# EAGLE design hausbus644 (EAGLE 5.10)
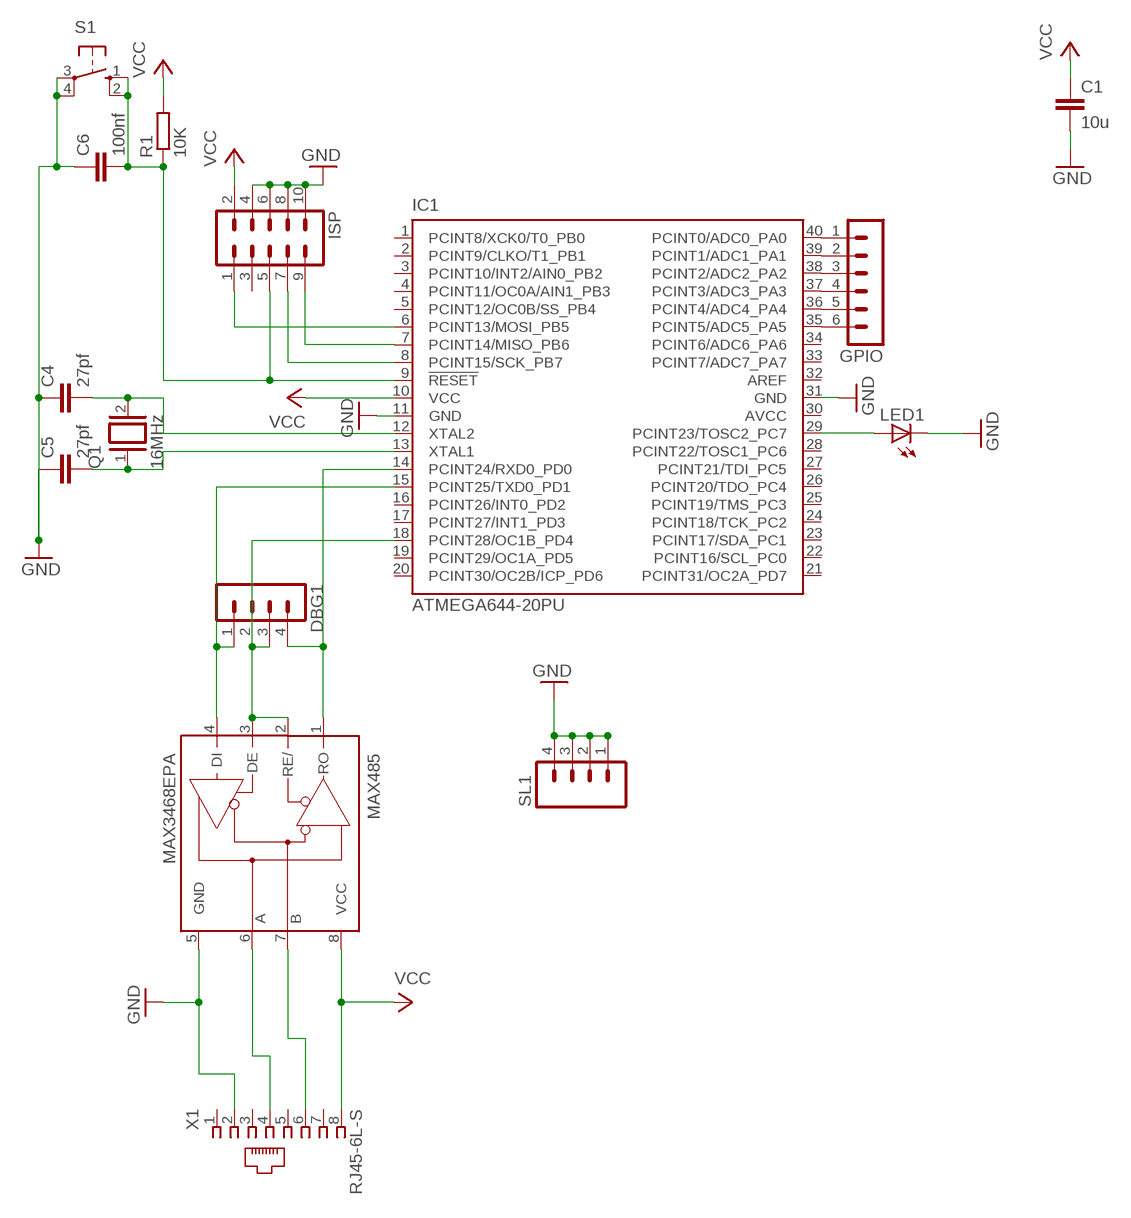
[diagram p0: schematic, sheet 1]

## Parts
C1  10u  C7.5/3  [C7.5B3]
C4  27pf  C2,5-3  [C2.5-3]
C5  27pf  C2,5-3  [C2.5-3]
C6  100nf  C2,5-3  [C2.5-3]
DBG1  MA04-1  [MA04-1]
GPIO  MA06-1  [MA06-1]
IC1  ATMEGA644-20PU  [DIL40]
ISP  ML10  [ML10]
LED1  LED5MM  [LED5MM]
MAX485  MAX3468EPA  [DIL08]
Q1  16MHz  XTAL/S  [QS]
R1  10K  R-EU_0204/7  [0204/7]
S1  10-XX  [B3F-10XX]
SL1  MA04  [04PA]
X1  RJ45-6L-S  [RJ45-NO-SHIELD]

## Nets
GND: C1.2 C4.1 C5.1 C6.1 IC1.11(GND) IC1.31(GND) ISP.4 ISP.6 ISP.8 ISP.10 LED1.K(C) MAX485.5(GND) S1.3(P) S1.4(P1) SL1.1 SL1.2 SL1.3 SL1.4 X1.2
N$1: MAX485.7(B) X1.6
N$2: DBG1.4 IC1.14(PCINT24/RXD0_PD0) MAX485.1(RO)
N$3: DBG1.1 IC1.15(PCINT25/TXD0_PD1) MAX485.4(DI)
N$4: DBG1.2 DBG1.3 IC1.18(PCINT28/OC1B_PD4) MAX485.2(RE/) MAX485.3(DE)
N$5: IC1.6(PCINT13/MOSI_PB5) ISP.1
N$6: C6.2 IC1.9(!RESET) ISP.5 R1.1 S1.1(S) S1.2(S1)
N$7: IC1.7(PCINT14/MISO_PB6) ISP.9
N$8: GPIO.1 IC1.40(PCINT0/ADC0_PA0)
N$9: C4.2 IC1.12(XTAL2) Q1.2
N$10: C5.2 IC1.13(XTAL1) Q1.1
N$11: GPIO.2 IC1.39(PCINT1/ADC1_PA1)
N$12: MAX485.6(A) X1.4
N$13: GPIO.3 IC1.38(PCINT2/ADC2_PA2)
N$14: GPIO.4 IC1.37(PCINT3/ADC3_PA3)
N$15: GPIO.5 IC1.36(PCINT4/ADC4_PA4)
N$16: GPIO.6 IC1.35(PCINT5/ADC5_PA5)
N$17: IC1.29(PCINT23/TOSC2_PC7) LED1.A
N$18: IC1.8(PCINT15/SCK_PB7) ISP.7
VCC: C1.1 IC1.10(VCC) ISP.2 MAX485.8(VCC) R1.2 X1.8
Unconnected: IC1.1(PCINT8/XCK0/T0_PB0) IC1.2(PCINT9/CLKO/T1_PB1) IC1.3(PCINT10/INT2/AIN0_PB2) IC1.4(PCINT11/OC0A/AIN1_PB3) IC1.5(PCINT12/OC0B/SS_PB4) IC1.16(PCINT26/INT0_PD2) IC1.17(PCINT27/INT1_PD3) IC1.19(PCINT29/OC1A_PD5) IC1.20(PCINT30/OC2B/ICP_PD6) IC1.21(PCINT31/OC2A_PD7) IC1.22(PCINT16/SCL_PC0) IC1.23(PCINT17/SDA_PC1) IC1.24(PCINT18/TCK_PC2) IC1.25(PCINT19/TMS_PC3) IC1.26(PCINT20/TDO_PC4) IC1.27(PCINT21/TDI_PC5) IC1.28(PCINT22/TOSC1_PC6) IC1.32(AREF) IC1.33(PCINT7/ADC7_PA7) IC1.34(PCINT6/ADC6_PA6) ISP.3 X1.1 X1.3 X1.5 X1.7

## Power pins joined to a net without a drawn wire
AVCC: IC1.30(AVCC)

## Library data of the parts
C1 C4-C6 = capacitor-wima:C: CAPACITOR naming: grid - package width
DBG1 = con-lstb:MA04-1: PIN HEADER
GPIO = con-lstb:MA06-1: PIN HEADER
IC1 = atmel:ATMEGA644-*PU: 8-bit Microcontroller with 64K Bytes In-System Programmable Flash Auto generated by make-symbol-device-package-bsdl.ulp Rev. 34 Source: http://www.atmel.com/dyn/resources/prod_documents/doc2593.pdf
ISP = con-harting-ml:ML10: HARTING
LED1 = led:LED: LED OSRAM: - CHIPLED LG R971, LG N971, LY N971, LG Q971, LY Q971, LO R971, LY R971 LH N974, LH R974 LS Q976, LO Q976, LY Q976 LO Q996 - Hyper CHIPLED LW Q18S LB Q993, LB Q99A, LB R99A - SideLED LS A670, LO A670, LY A670, LG A670, LP A670 LB A673, LV A673, LT A673, LW A673 LH A674 LY A675 LS A676, LA A676, LO A676, LY A676, LW A676 LS A679, LY A679, LG A679 - Hyper Micro SIDELED® LS Y876, LA Y876, LO Y876, LY Y876 LT Y87S - SmartLED LW L88C, LW L88S LB L89C, LB L89S, LG L890 LS L89K, LO L89K, LY L89K LS L896, LA L896, LO L896, LY L896 - TOPLED LS T670, LO T670, LY T670, LG T670, LP T670 LSG T670, LSP T670, LSY T670, LOP T670, LYG T670 LG T671, LOG T671, LSG T671 LB T673, LV T673, LT T673, LW T673 LH T674 LS T676, LA T676, LO T676, LY T676, LB T676, LH T676, LSB T676, LW T676 LB T67C, LV T67C, LT T67C, LS T67K, LO T67K, LY T67K, LW E67C LS E67B, LA E67B, LO E67B, LY E67B, LB E67C, LV E67C, LT E67C LW T67C LS T679, LY T679, LG T679 LS T770, LO T770, LY T770, LG T770, LP T770 LB T773, LV T773, LT T773, LW T773 LH T774 LS E675, LA E675, LY E675, LS T675 LS T776, LA T776, LO T776, LY T776, LB T776 LHGB T686 LT T68C, LB T68C - Hyper Mini TOPLED® LB M676 - Mini TOPLED Santana® LG M470 LS M47K, LO M47K, LY M47K Source: http://www.osram.convergy.de LUXEON: - LUMILED® LXK2-PW12-R00, LXK2-PW12-S00, LXK2-PW14-U00, LXK2-PW14-V00 LXK2-PM12-R00, LXK2-PM12-S00, LXK2-PM14-U00 LXK2-PE12-Q00, LXK2-PE12-R00, LXK2-PE12-S00, LXK2-PE14-T00, LXK2-PE14-U00 LXK2-PB12-K00, LXK2-PB12-L00, LXK2-PB12-M00, LXK2-PB14-N00, LXK2-PB14-P00, LXK2-PB14-Q00 LXK2-PR12-L00, LXK2-PR12-M00, LXK2-PR14-Q00, LXK2-PR14-R00 LXK2-PD12-Q00, LXK2-PD12-R00, LXK2-PD12-S00 LXK2-PH12-R00, LXK2-PH12-S00 LXK2-PL12-P00, LXK2-PL12-Q00, LXK2-PL12-R00 Source: www.luxeon.com KINGBRIGHT: KA-3528ASYC Source: www.kingbright.com
MAX485 = maxim:MAX34*: +5V, Fail-Safe, 40Mbps, Profibus RS-485/RS-422 Transceivers Source: MAX3465-MAX3469.pdf
Q1 = special:XTAL/S: CRYSTAL
R1 = resistor:R-EU_: RESISTOR, European symbol
S1 = switch-omron:10-XX: OMRON SWITCH
SL1 = con-amp-quick:MA04: AMP QUICK CONNECTOR
X1 = con-tycoelectronics:RJ45: CORCOM Modular RJ Jacks No Shield Source: www.tycoelectronics.com .. ENG_DS_1654001_1099_RJ_L_0507.pdf

## Board
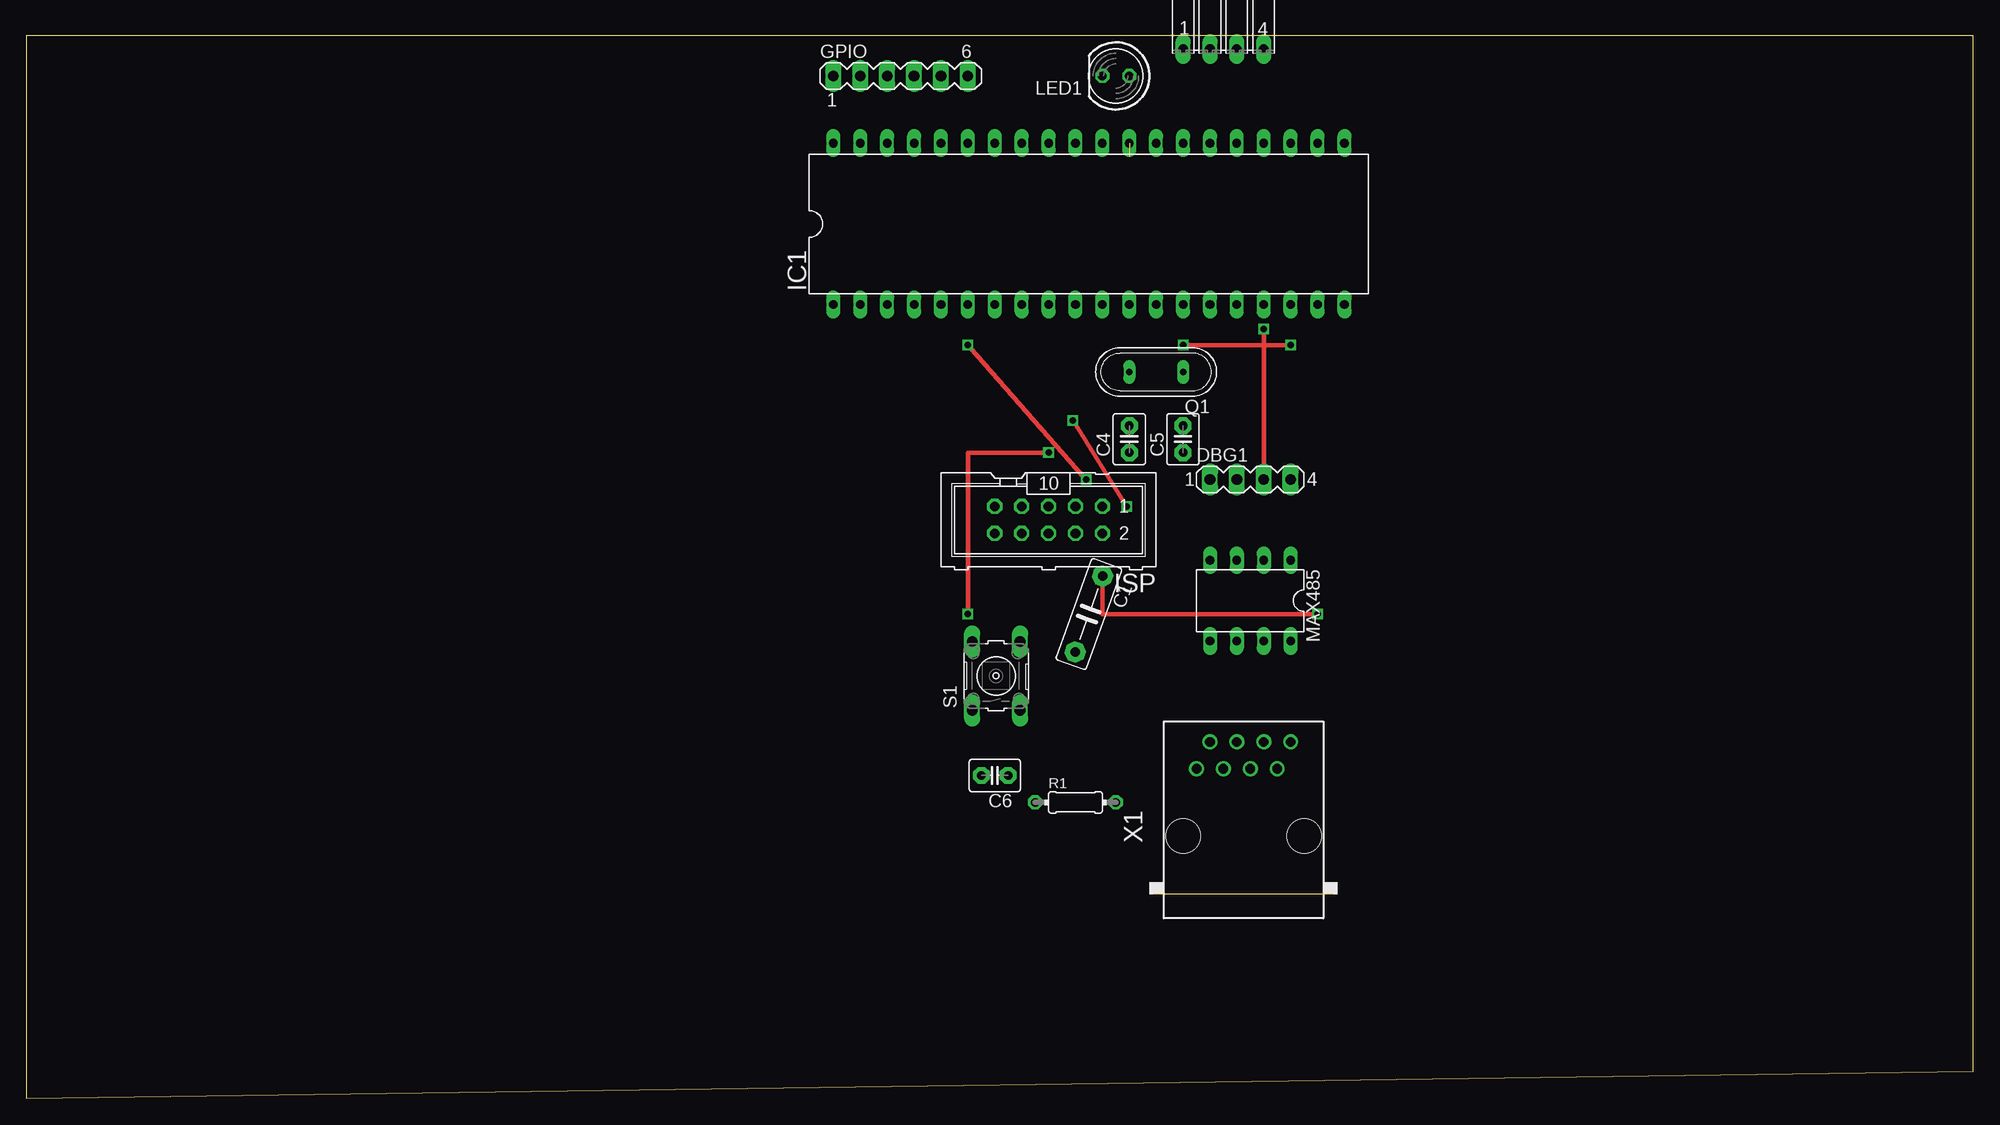
[diagram p1: board, top side]
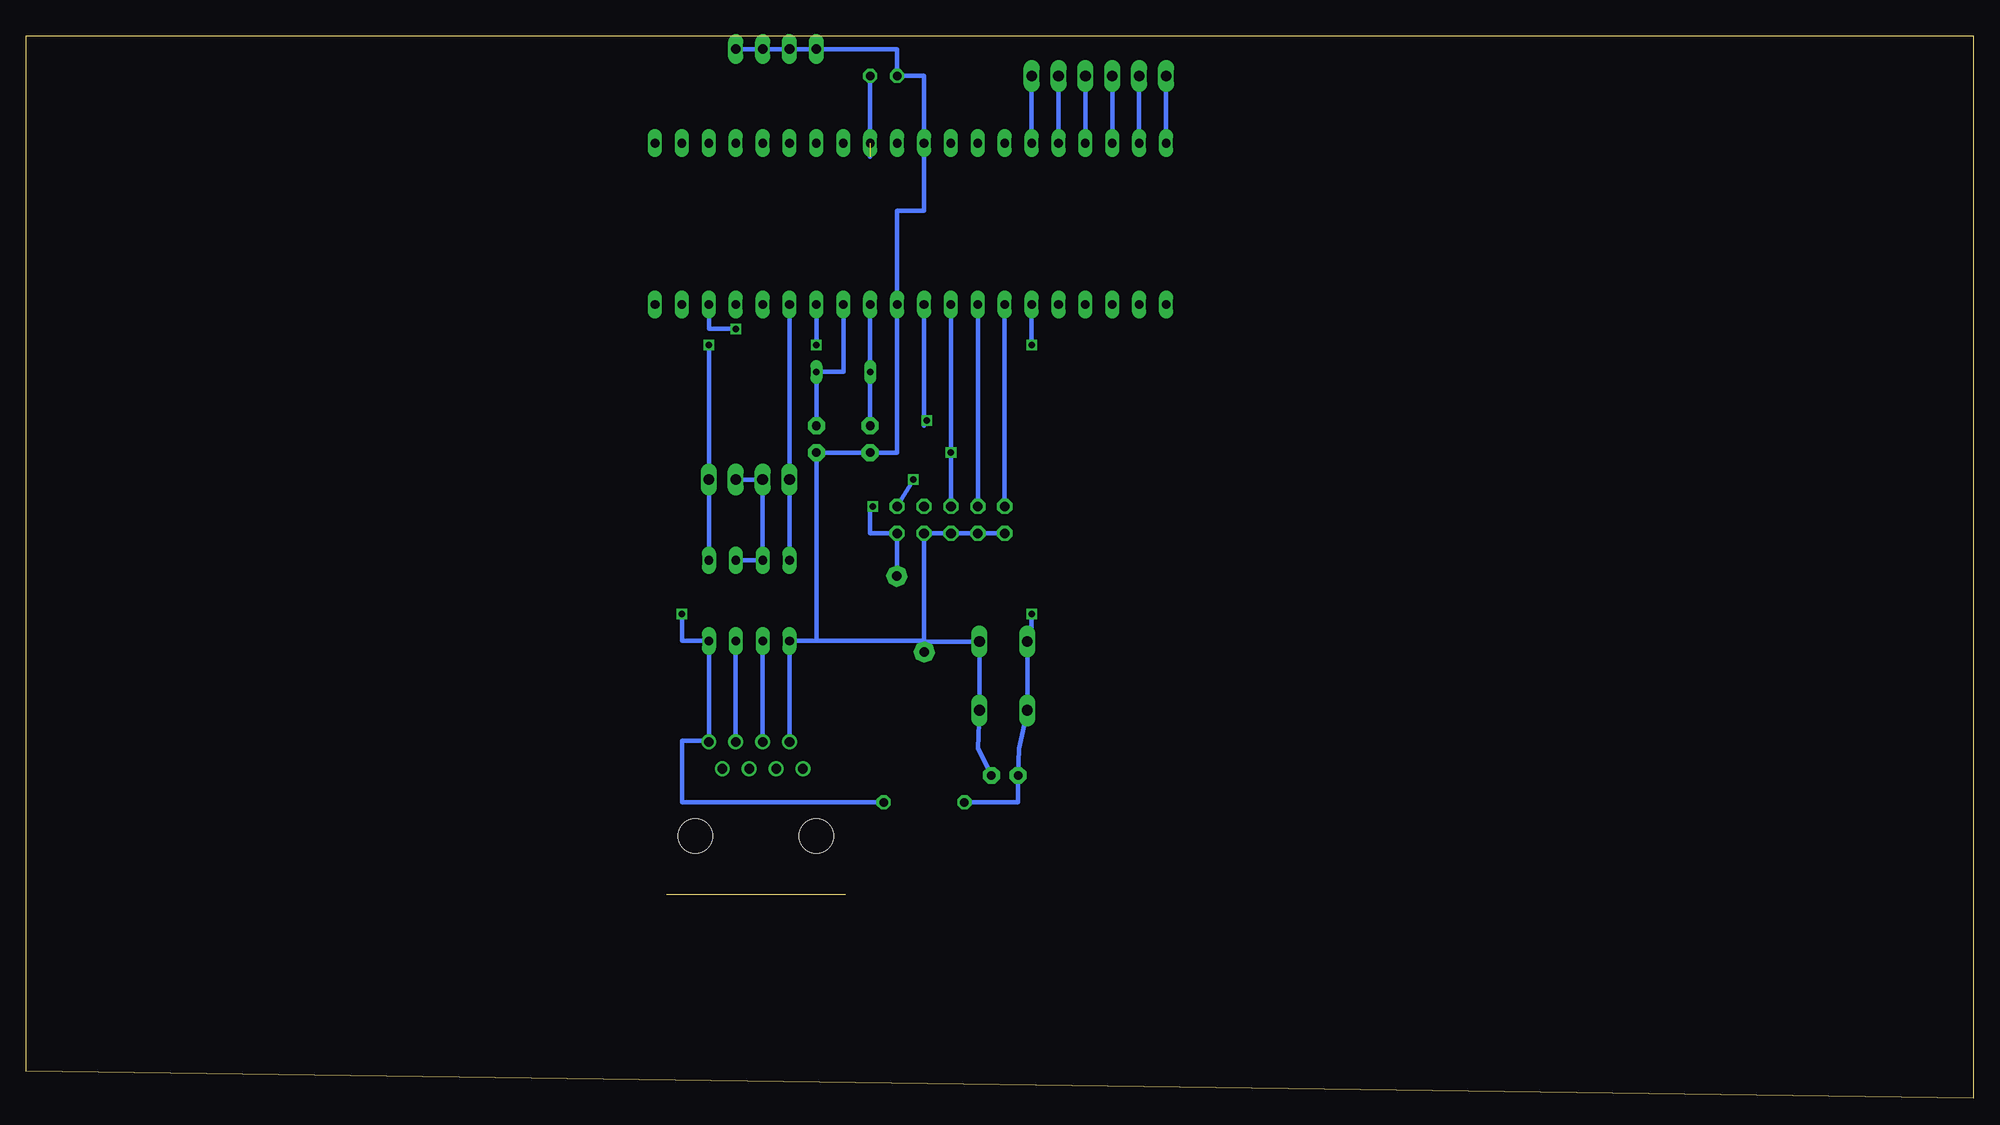
[diagram p2: board, bottom side, seen from below]

Size 183.82 x 100.32 mm. Coordinates in mm from the lower left corner, seen from the top.
Outline: 0,0 183.82,2.54 183.82,100.32 0,100.32 0,0
Copper layers (1*16): Top 0.035mm / dielectric 1.5mm / Bottom 0.035mm
Design rules "default *": minimum track width 10mil, minimum drill 1mil, track to track 8mil, track to pad 8mil, pad to pad 8mil, via to via 8mil, smd to smd 8mil, copper to edge 8mil, drill to drill 8mil, minimum pad ring 10mil, minimum via ring 8mil, stop-mask expansion 0mil, vias tented up to drill 0mil, thermal gap 10mil

### Footprints (pad centres in the part's own frame; a part is rotated, then mirrored left to right if it is on the bottom)
C7.5B3 = drill 0.914 pad 1.905 octagon: 1 -3.81,0; 2 3.81,0
C2.5-3 = drill 0.813 pad 1.6 octagon: 1 -1.27,0; 2 1.27,0
MA04-1 = drill 1.016 long: 1 -3.81,0; 2 -1.27,0; 3 1.27,0; 4 3.81,0
MA06-1 = drill 1.016 long: 1 -6.35,0; 2 -3.81,0; 3 -1.27,0; 4 1.27,0; 5 3.81,0; 6 6.35,0
DIL40 = drill 0.813 long: 1 -24.13,-7.62; 2 -21.59,-7.62; 3 -19.05,-7.62; 4 -16.51,-7.62; 5 -13.97,-7.62; 6 -11.43,-7.62; 7 -8.89,-7.62; 8 -6.35,-7.62; 9 -3.81,-7.62; 10 -1.27,-7.62; 11 1.27,-7.62; 12 3.81,-7.62; 13 6.35,-7.62; 14 8.89,-7.62; 15 11.43,-7.62; 16 13.97,-7.62; 17 16.51,-7.62; 18 19.05,-7.62; 19 21.59,-7.62; 20 24.13,-7.62; 21 24.13,7.62; 22 21.59,7.62; 23 19.05,7.62; 24 16.51,7.62; 25 13.97,7.62; 26 11.43,7.62; 27 8.89,7.62; 28 6.35,7.62; 29 3.81,7.62; 30 1.27,7.62; 31 -1.27,7.62; 32 -3.81,7.62; 33 -6.35,7.62; 34 -8.89,7.62; 35 -11.43,7.62; 36 -13.97,7.62; 37 -16.51,7.62; 38 -19.05,7.62; 39 -21.59,7.62; 40 -24.13,7.62
ML10 = drill 0.914 octagon: 1 -5.08,-1.27; 2 -5.08,1.27; 3 -2.54,-1.27; 4 -2.54,1.27; 5 0,-1.27; 6 0,1.27; 7 2.54,-1.27; 8 2.54,1.27; 9 5.08,-1.27; 10 5.08,1.27
LED5MM = drill 0.813 octagon: A -1.27,0; K 1.27,0
DIL08 = drill 0.813 long: 1 -3.81,-3.81; 2 -1.27,-3.81; 3 1.27,-3.81; 4 3.81,-3.81; 5 3.81,3.81; 6 1.27,3.81; 7 -1.27,3.81; 8 -3.81,3.81
QS = drill 0.61 long: 1 -2.54,0; 2 2.54,0
0204/7 = drill 0.813 octagon: 1 -3.81,0; 2 3.81,0
B3F-10XX = drill 1.016 long: 1 -3.251,2.261; 2 3.251,2.261; 3 -3.251,-2.261; 4 3.251,-2.261
04PA = drill 0.914 long: 1 -3.81,0; 2 -1.27,0; 3 1.27,0; 4 3.81,0
RJ45-NO-SHIELD = drill 0.9 pad 1.4 round: 1 -4.445,6.35; 2 -3.175,8.89; 3 -1.905,6.35; 4 -0.635,8.89; 5 0.635,6.35; 6 1.905,8.89; 7 3.175,6.35; 8 4.445,8.89 | hole 3.251: -5.715,0; 5.715,0

### Placement (x,y rotation side)
C1  100.33,45.72 250.1 top
C4  104.14,62.23 90 top
C5  109.22,62.23 90 top
C6  91.44,30.48 180 top
DBG1  115.57,58.42 0 top
GPIO  82.55,96.52 0 top
IC1  100.33,82.55 0 top
ISP  96.52,54.61 180 top
LED1  102.87,96.52 180 top
MAX485  115.57,46.99 180 top
Q1  106.68,68.58 180 top
R1  99.06,27.94 0 top
S1  91.57,39.88 90 top
SL1  113.03,99.06 0 top
X1  114.94,24.77 0 top

### Tracks (layer width: path | path; a pad name or v marks a point on that pad's centre or on a via)
GND
  Bottom 0.406: C6.1 93.98,33.05 S1.3 S1.4 99.06,43.13 99.06,43.18 | ISP.10 ISP.8 ISP.6 ISP.4 99.06,43.18 | 109.22,43.18 C5.1 C4.1 101.6,60.96 IC1.11 101.6,83.82 99.06,83.82 IC1.31 99.06,96.52 LED1.K 101.6,99.06 SL1.1 SL1.2 SL1.3 SL1.4 | X1.2 MAX485.5 109.22,43.18 | 99.06,43.18 109.22,43.18 | 99.06,43.18 C1.2
N$1
  Bottom 0.406: X1.6 MAX485.7
N$2  (via drill 0.6)
  Top 0.406: v119.38,71.12 v109.22,71.12
  Bottom 0.406: v109.22,71.12 IC1.14 | v119.38,71.12 DBG1.4 MAX485.1
N$3
  Bottom 0.406: IC1.15 DBG1.1 MAX485.4
N$4  (via drill 0.6)
  Top 0.406: DBG1.3 v116.84,72.64
  Bottom 0.406: DBG1.3 DBG1.2 MAX485.3 MAX485.2 | v116.84,72.64 119.38,72.64 IC1.18
N$5  (via drill 0.6)
  Top 0.406: v100.08,58.42 v88.9,71.12
  Bottom 0.406: v88.9,71.12 IC1.6 | ISP.1 v100.08,58.42
N$6  (via drill 0.6)
  Top 0.406: v88.9,45.72 88.9,60.96 v96.52,60.96
  Bottom 0.406: R1.1 90.17,27.94 C6.2 90.09,33.02 S1.1 S1.2 88.9,43.13 v88.9,45.72 | ISP.5 v96.52,60.96 IC1.9
N$7
  Bottom 0.406: ISP.9 IC1.7
N$8
  Bottom 0.406: IC1.40 GPIO.1
N$9
  Bottom 0.406: C4.2 Q1.2 IC1.12
N$10
  Bottom 0.406: C5.2 Q1.1 106.68,68.58 IC1.13
N$11
  Bottom 0.406: IC1.39 GPIO.2
N$12
  Bottom 0.406: X1.4 MAX485.6
N$13
  Bottom 0.406: IC1.38 GPIO.3
N$14
  Bottom 0.406: IC1.37 GPIO.4
N$15
  Bottom 0.406: IC1.36 GPIO.5
N$16
  Bottom 0.406: IC1.35 GPIO.6
N$17  (1 unrouted)
  Bottom 0.406: 104.14,88.9 LED1.A
N$18
  Bottom 0.406: ISP.7 IC1.8
VCC  (via drill 0.6)
  Top 0.406: C1.1 101.6,49.3 101.6,45.72 v121.92,45.72 | v103.89,55.88 v98.81,64.01
  Bottom 0.406: v121.92,45.72 121.92,43.18 MAX485.8 X1.8 119.38,33.78 121.92,33.78 121.92,27.94 R1.2 | C1.1 101.6,49.3 ISP.2 104.14,53.34 104.14,55.88 v103.89,55.88 | 99.06,64.01 99.06,63.5 | v98.81,64.01 99.06,64.01 | 99.06,64.01 IC1.10